# EAGLE design motor_pcb (EAGLE 7.2.0)
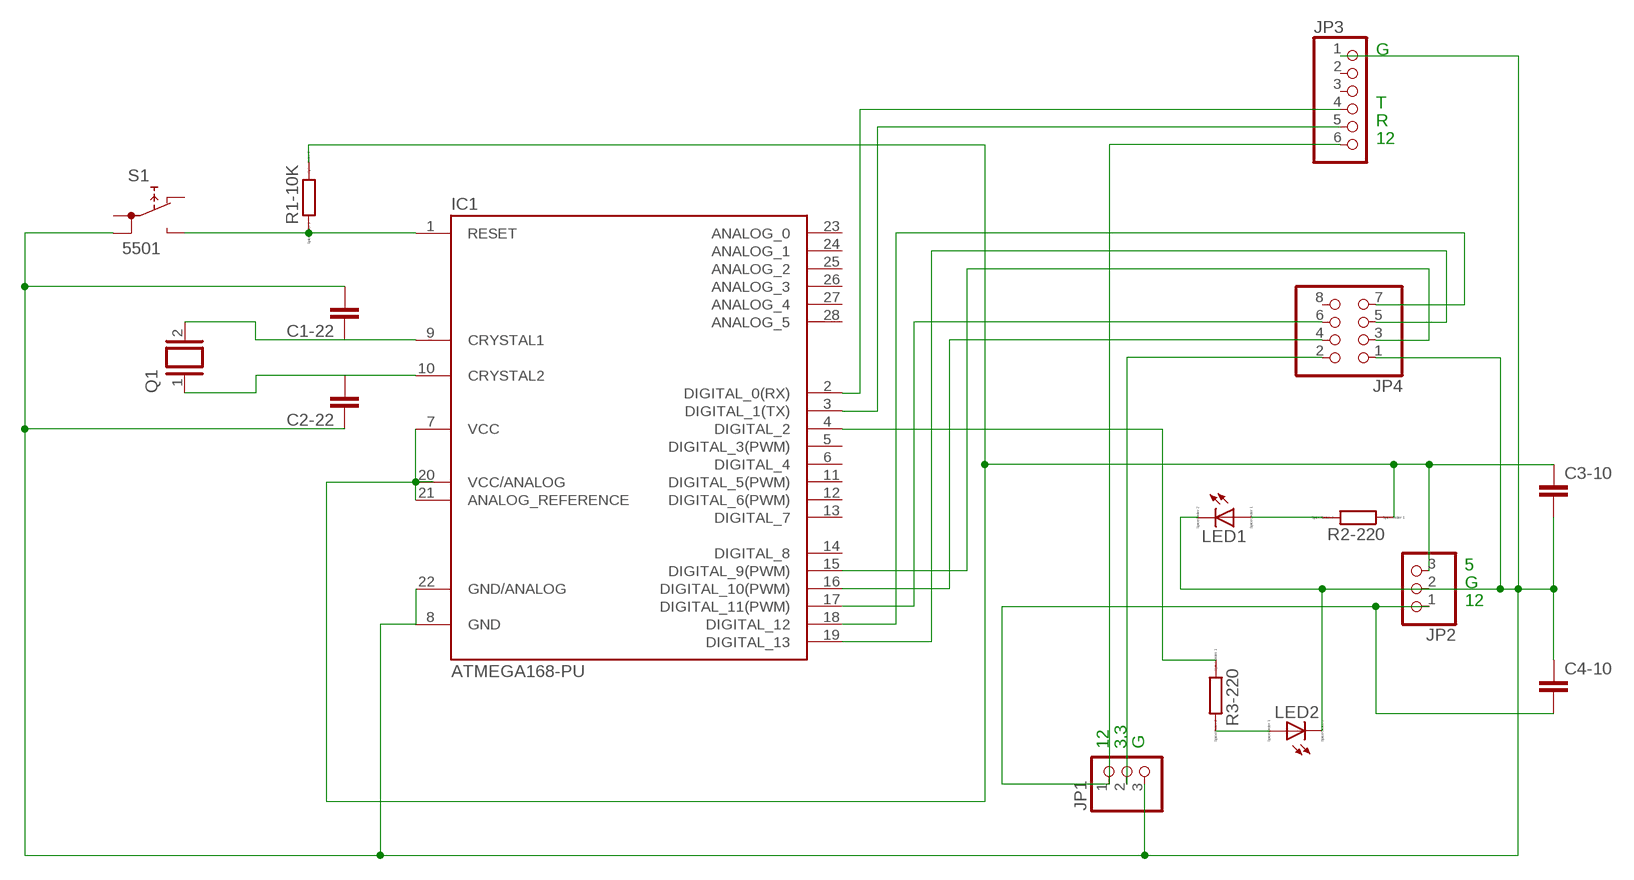
[diagram p0: schematic, sheet 1]

## Parts
C1-22  C2.5/2  [C2.5-2]
C2-22  C2.5/2  [C2.5-2]
C3-10  C2.5/2  [C2.5-2]
C4-10  C2.5/2  [C2.5-2]
IC1  ATMEGA168-PU  [DIL28-3]
JP1  PINHD-1X3  [1X03]
JP2  PINHD-1X3  [1X03]
JP3  PINHD-1X6  [1X06]
JP4  PINHD-2X4  [2X04]
LED1  LED_ELD260  [LED_LD260]
LED2  LED_ELD260  [LED_LD260]
Q1  XTAL/S  [QS]
R1-10K  R0204/7  [0204/7]
R2-220  R0204/7  [0204/7]
R3-220  R0204/7  [0204/7]
S1  5501  [5501]

## Nets
N$1: IC1.1(RESET) R1-10K.1 S1.NO
N$2: C1-22.2 C2-22.1 C3-10.2 C4-10.1 IC1.8(GND) IC1.22(GND/ANALOG) JP1.3 JP2.2 JP3.1 JP4.1 LED1.K(C) LED2.K(C) S1.1B
N$3: C1-22.1 IC1.9(CRYSTAL1) Q1.2
N$4: C2-22.2 IC1.10(CRYSTAL2) Q1.1
N$5: C4-10.2 JP1.1 JP2.1 JP3.6
N$6: JP1.2 JP4.2
N$7: C3-10.1 IC1.7(VCC) IC1.20(VCC/ANALOG) IC1.21(ANALOG_REFERENCE) JP2.3 R1-10K.2 R2-220.1
N$8: IC1.3(DIGITAL_1(TX)) JP3.5
N$9: IC1.15(DIGITAL_9(PWM)) JP4.3
N$10: IC1.16(DIGITAL_10(PWM)) JP4.4
N$11: IC1.19(DIGITAL_13) JP4.5
N$12: IC1.17(DIGITAL_11(PWM)) JP4.6
N$13: IC1.18(DIGITAL_12) JP4.7
N$14: IC1.2(DIGITAL_0(RX)) JP3.4
N$15: LED1.A R2-220.2
N$17: IC1.4(DIGITAL_2) R3-220.1
N$18: LED2.A R3-220.2
Unconnected: IC1.5(DIGITAL_3(PWM)) IC1.6(DIGITAL_4) IC1.11(DIGITAL_5(PWM)) IC1.12(DIGITAL_6(PWM)) IC1.13(DIGITAL_7) IC1.14(DIGITAL_8) IC1.23(ANALOG_0) IC1.24(ANALOG_1) IC1.25(ANALOG_2) IC1.26(ANALOG_3) IC1.27(ANALOG_4) IC1.28(ANALOG_5) JP3.2 JP3.3 JP4.8 S1.1A S1.NC

## Notes on the sheet
- G
- T
- R
- 12
- 5
- G
- 12
- 12 | 3.3 | G

## Library data of the parts
C1-22 C2-22 C3-10 C4-10 = capacitor-wima:C: CAPACITOR naming: grid - package width
IC1 = Arduino-AVR:ATMEGA168-PU
JP1 JP2 = pinhead:PINHD-1X3: PIN HEADER
JP3 = pinhead:PINHD-1X6: PIN HEADER
JP4 = pinhead:PINHD-2X4: PIN HEADER
LED1 LED2 = eagle-ltspice:LED_E: LED Source: http://www.osram.convergy.de Source: www.luxeon.com Source: www.kingbright.com; SPICEMODEL: NONE; SPICEPREFIX: D; SPICETYPE: diode
Q1 = special:XTAL/S: CRYSTAL
R1-10K R2-220 R3-220 = eagle-ltspice:R: RESISTOR, European symbol; SPICEMODEL: NONE; SPICEPREFIX: R
S1 = switch:55?: PUSHBUTTON SERIES 5500 SWITCHES Source: www.e-switch.com .. 5500.pdf

## Board
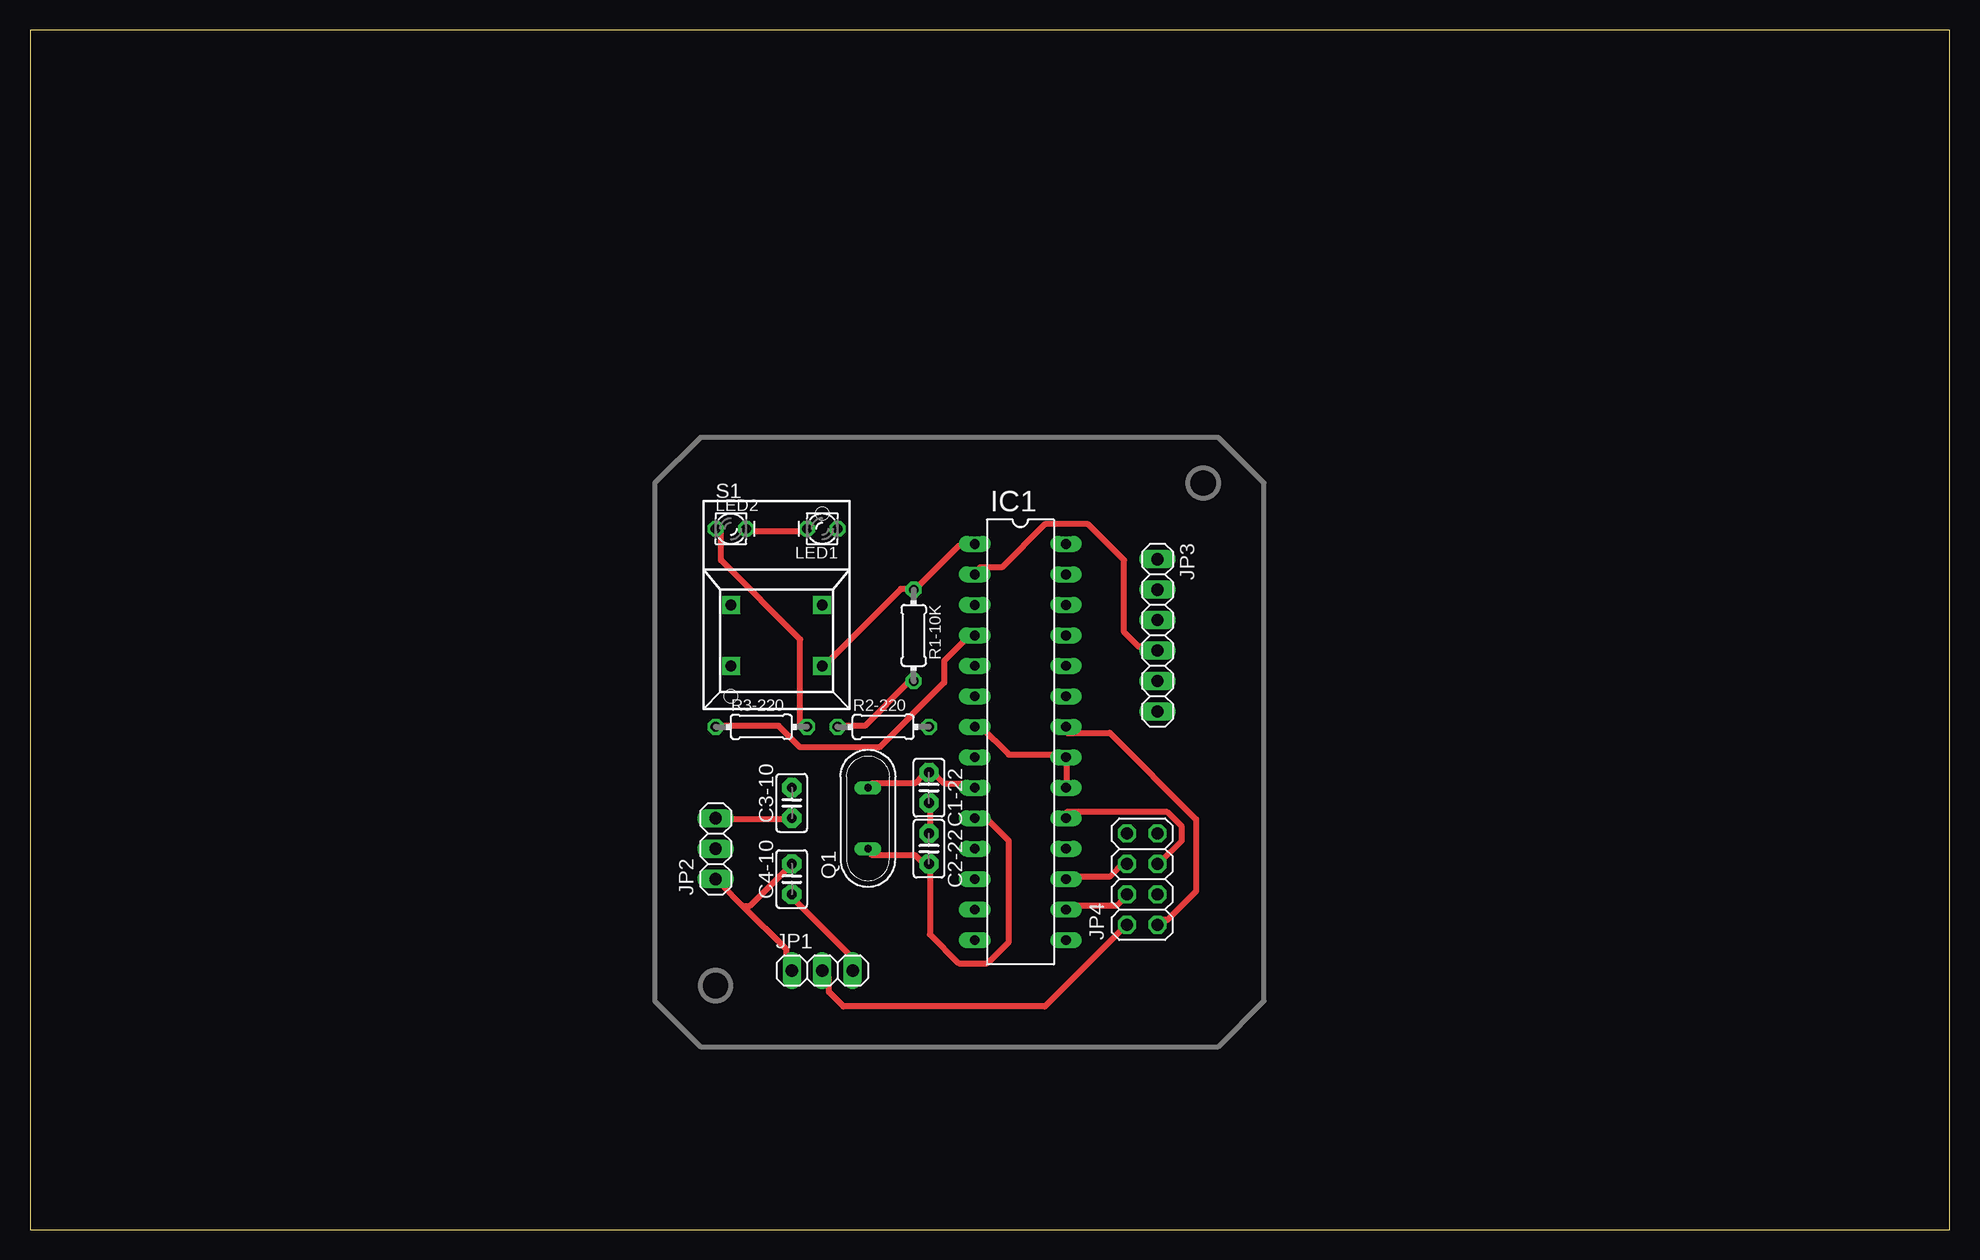
[diagram p1: board, top side]
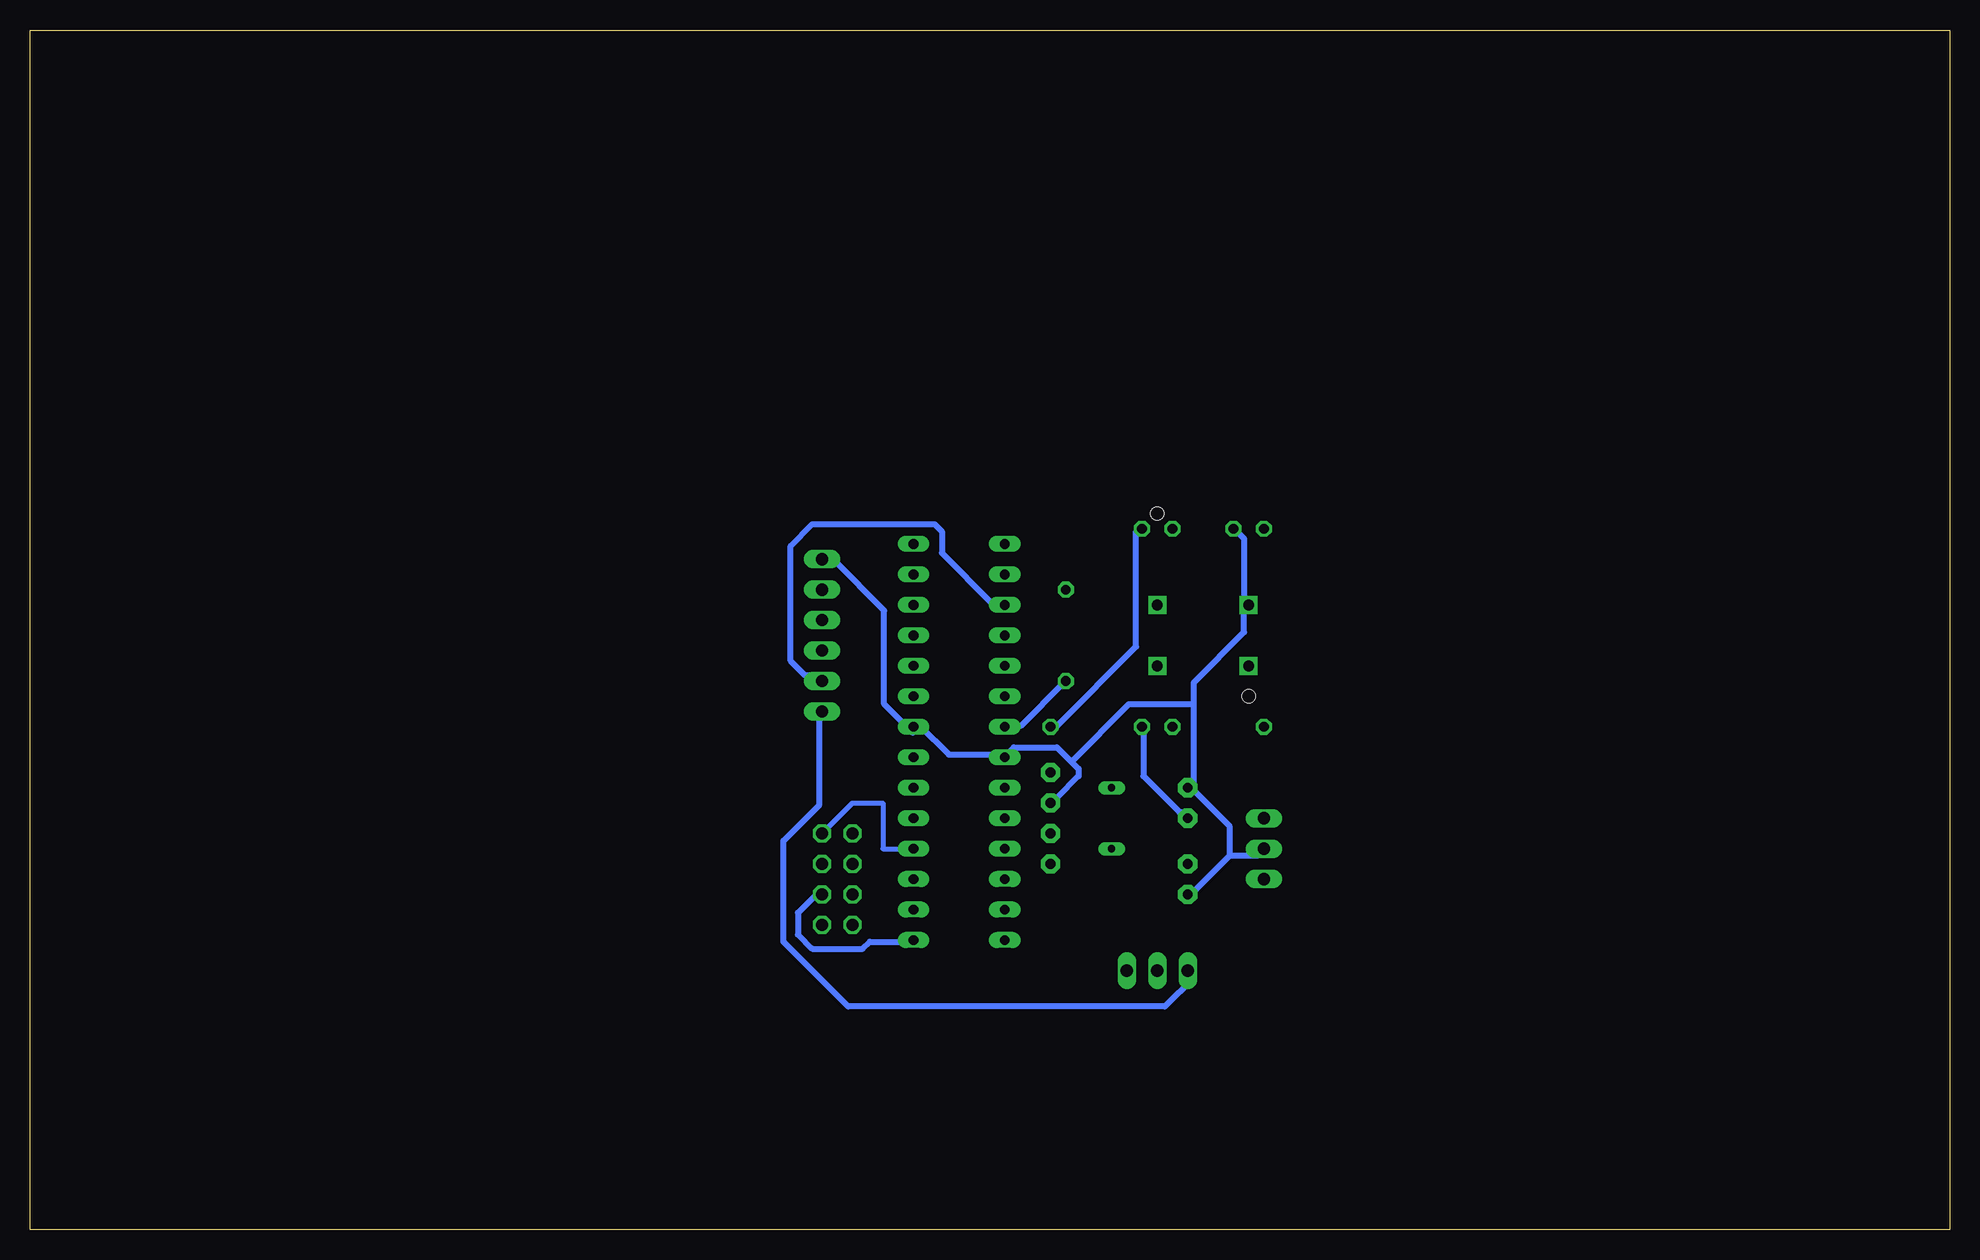
[diagram p2: board, bottom side, seen from below]

Size 160 x 100 mm. Coordinates in mm from the lower left corner, seen from the top.
Outline: 0,0 160,0 160,100 0,100 0,0
Copper layers (1*16): Top 0.035mm / dielectric 1.5mm / Bottom 0.035mm
Design rules "default *": minimum track width 0.5mm, minimum drill 24mil, track to track 0.7mm, track to pad 0.7mm, pad to pad 0.7mm, via to via 0.7mm, smd to smd 0.7mm, copper to edge 40mil, drill to drill 8mil, minimum pad ring 10mil, minimum via ring 8mil, stop-mask expansion 4mil, vias tented up to drill 0mil, thermal gap 10mil

### Footprints (pad centres in the part's own frame; a part is rotated, then mirrored left to right if it is on the bottom)
C2.5-2 = drill 0.813 pad 1.6 octagon: 1 -1.27,0; 2 1.27,0
DIL28-3 = drill 0.813 long: 1 -16.51,-3.81; 2 -13.97,-3.81; 3 -11.43,-3.81; 4 -8.89,-3.81; 5 -6.35,-3.81; 6 -3.81,-3.81; 7 -1.27,-3.81; 8 1.27,-3.81; 9 3.81,-3.81; 10 6.35,-3.81; 11 8.89,-3.81; 12 11.43,-3.81; 13 13.97,-3.81; 14 16.51,-3.81; 15 16.51,3.81; 16 13.97,3.81; 17 11.43,3.81; 18 8.89,3.81; 19 6.35,3.81; 20 3.81,3.81; 21 1.27,3.81; 22 -1.27,3.81; 23 -3.81,3.81; 24 -6.35,3.81; 25 -8.89,3.81; 26 -11.43,3.81; 27 -13.97,3.81; 28 -16.51,3.81
1X03 = drill 1.016 long: 1 -2.54,0; 2 0,0; 3 2.54,0
1X06 = drill 1.016 long: 1 -6.35,0; 2 -3.81,0; 3 -1.27,0; 4 1.27,0; 5 3.81,0; 6 6.35,0
2X04 = drill 1.016 octagon: 1 -3.81,-1.27; 2 -3.81,1.27; 3 -1.27,-1.27; 4 -1.27,1.27; 5 1.27,-1.27; 6 1.27,1.27; 7 3.81,-1.27; 8 3.81,1.27
LED_LD260 = drill 0.813 octagon: A -1.27,0; K 1.27,0
QS = drill 0.61 long: 1 -2.54,0; 2 2.54,0
0204/7 = drill 0.813 octagon: 1 -3.81,0; 2 3.81,0
5501 = drill 0.9 pad 1.5 square: 1A 0,3.81; 1B 0,-3.81; NC 5.08,-3.81; NO 5.08,3.81 | hole 1.1: -7.62,3.81; 7.62,-3.81

### Placement (x,y rotation side)
C1-22  74.93,36.83 270 top
C2-22  74.93,31.75 270 top
C3-10  63.5,35.56 90 top
C4-10  63.5,29.21 90 top
IC1  82.55,40.64 270 top
JP1  66.04,21.59 0 top
JP2  57.15,31.75 90 top
JP3  93.98,49.53 270 top
JP4  92.71,29.21 90 top
LED1  66.04,58.42 180 top
LED2  58.42,58.42 0 top
Q1  69.85,34.29 90 top
R1-10K  73.66,49.53 270 top
R2-220  71.12,41.91 0 top
R3-220  60.96,41.91 0 top
S1  62.23,52.07 270 top

### Tracks (layer width: path | path; a pad name or v marks a point on that pad's centre or on a via)
N$1
  Top 0.5: IC1.1 78.6,57 77.4,57 73.8,53.4 R1-10K.1 73.2,53.4 72.6,53.4 66.6,47.4 S1.NO
N$2
  Top 0.5: LED2.K 60,58.2 64.2,58.2 LED1.K | JP1.3 68.4,21.6 68.4,22.8 63.6,27.6 C4-10.1 | C2-22.1 75,33.6 75,35.4 C1-22.2 | JP4.1 94.2,25.8 94.8,25.8 97.2,28.2 97.2,34.2 90,41.4 86.4,41.4 IC1.22
  Bottom 0.5: LED2.K 59.4,58.2 58.8,57.6 58.8,52.2 S1.1B 58.8,51.6 58.8,49.8 63,45.6 63,43.8 | 60,31.2 57.6,31.2 JP2.2 | 60,31.2 63,28.2 C4-10.1 | 60,31.2 60,33.6 63,36.6 C3-10.2 63,37.2 63,43.8 | JP3.1 93.6,55.8 93,55.8 88.8,51.6 88.8,43.8 86.4,41.4 IC1.22 85.8,42 83.4,39.6 79.2,39.6 IC1.8 78.6,39.6 78,40.2 74.4,40.2 73.2,39 | 73.2,39 72.6,38.4 72.6,37.8 74.4,36 C1-22.2 | 63,43.8 68.4,43.8 73.2,39
N$3
  Top 0.5: Q1.2 70.2,37.2 73.8,37.2 74.4,37.8 C1-22.1 75,38.4 76.2,37.2 78.6,37.2 IC1.9
N$4
  Top 0.5: Q1.1 70.2,31.2 73.8,31.2 74.4,30.6 C2-22.2 75,30 75,24.6 77.4,22.2 79.8,22.2 81.6,24 81.6,32.4 79.8,34.2 79.2,34.2 IC1.10
N$5
  Top 0.5: 59.4,27 57.6,28.8 JP2.1 | 59.4,27 63,23.4 63,21.6 JP1.1 | 59.4,27 60,27 63,30 C4-10.2
  Bottom 0.5: JP3.6 94.2,42.6 94.2,35.4 97.2,32.4 97.2,24 91.8,18.6 65.4,18.6 63,21 JP1.1
N$6
  Top 0.5: JP1.2 66.6,21 66.6,19.8 67.8,18.6 84.6,18.6 91.2,25.2 JP4.2
N$7
  Top 0.5: JP2.3 57.6,34.2 63,34.2 C3-10.1 | IC1.20 86.4,37.2 86.4,39 IC1.21 85.8,39.6 81.6,39.6 79.2,42 IC1.7 | R2-220.1 67.8,42 69.6,42 73.2,45.6 R1-10K.2
  Bottom 0.5: IC1.7 78.6,42 77.4,42 73.8,45.6 R1-10K.2 | C3-10.1 63.6,34.8 64.2,34.8 67.2,37.8 67.2,41.4 R2-220.1
N$8
  Bottom 0.5: IC1.3 79.2,52.2 79.8,52.2 84,56.4 84,58.2 84.6,58.8 94.8,58.8 96.6,57 96.6,47.4 95.4,46.2 94.2,46.2 JP3.5
N$9
  Bottom 0.5: IC1.15 86.4,24 90,24 90.6,23.4 94.8,23.4 96,24.6 96,26.4 94.2,28.2 JP4.3
N$10
  Top 0.5: IC1.16 86.4,27 90.6,27 91.2,27.6 JP4.4
N$11
  Top 0.5: IC1.19 86.4,34.8 94.8,34.8 96,33.6 96,32.4 94.2,30.6 JP4.5
N$12
  Top 0.5: IC1.17 86.4,29.4 90,29.4 91.2,30.6 JP4.6
N$13
  Bottom 0.406: JP4.7 91.44,35.56 88.9,35.56 88.9,31.75 IC1.18
N$14
  Top 0.5: IC1.2 79.2,55.2 81,55.2 84.6,58.8 88.2,58.8 91.2,55.8 91.2,49.8 92.4,48.6 93.6,48.6 JP3.4
N$15
  Bottom 0.5: LED1.A 67.8,58.2 67.8,48.6 74.4,42 R2-220.2
N$17
  Top 0.5: R3-220.1 57.6,42 62.4,42 64.2,40.2 70.8,40.2 76.2,45.6 76.2,47.4 78.6,49.8 IC1.4
N$18
  Top 0.5: LED2.A 57.6,58.2 57.6,55.8 64.2,49.2 64.2,42 R3-220.2

### Text on the board
tDocu: IEEE UPP FUNDED | S | S | L2 | L1 | G | 10k | T | R | 12 | 5 | S | 12 | 12 | 3 | G | 3 | G | SRL - NASA